# Altium schematic sheet llrf_afe_fpga_bridge.SchDoc: =GlobalProjectName
size 594 x 420 mm; SheetNumber: 7; SheetTotal: 20; PageSetup: Record=PageOptions|CenterHorizontal=True|CenterVertical=True|PrintScale=1.00|XCorrection=1.00|YCorrection=1.00|PrintKind=1|BorderSize=5000000|LeftOffset=0|BottomOffset=0|Orientation=2|PaperLength=1000|PaperWidth=1000|Scale=100|PaperSource=15|PrintQuality=1200|MediaType=1|DitherType=10|PaperKind=A3|PrintScaleMode=1; Weight: -; ScaleFactor: -
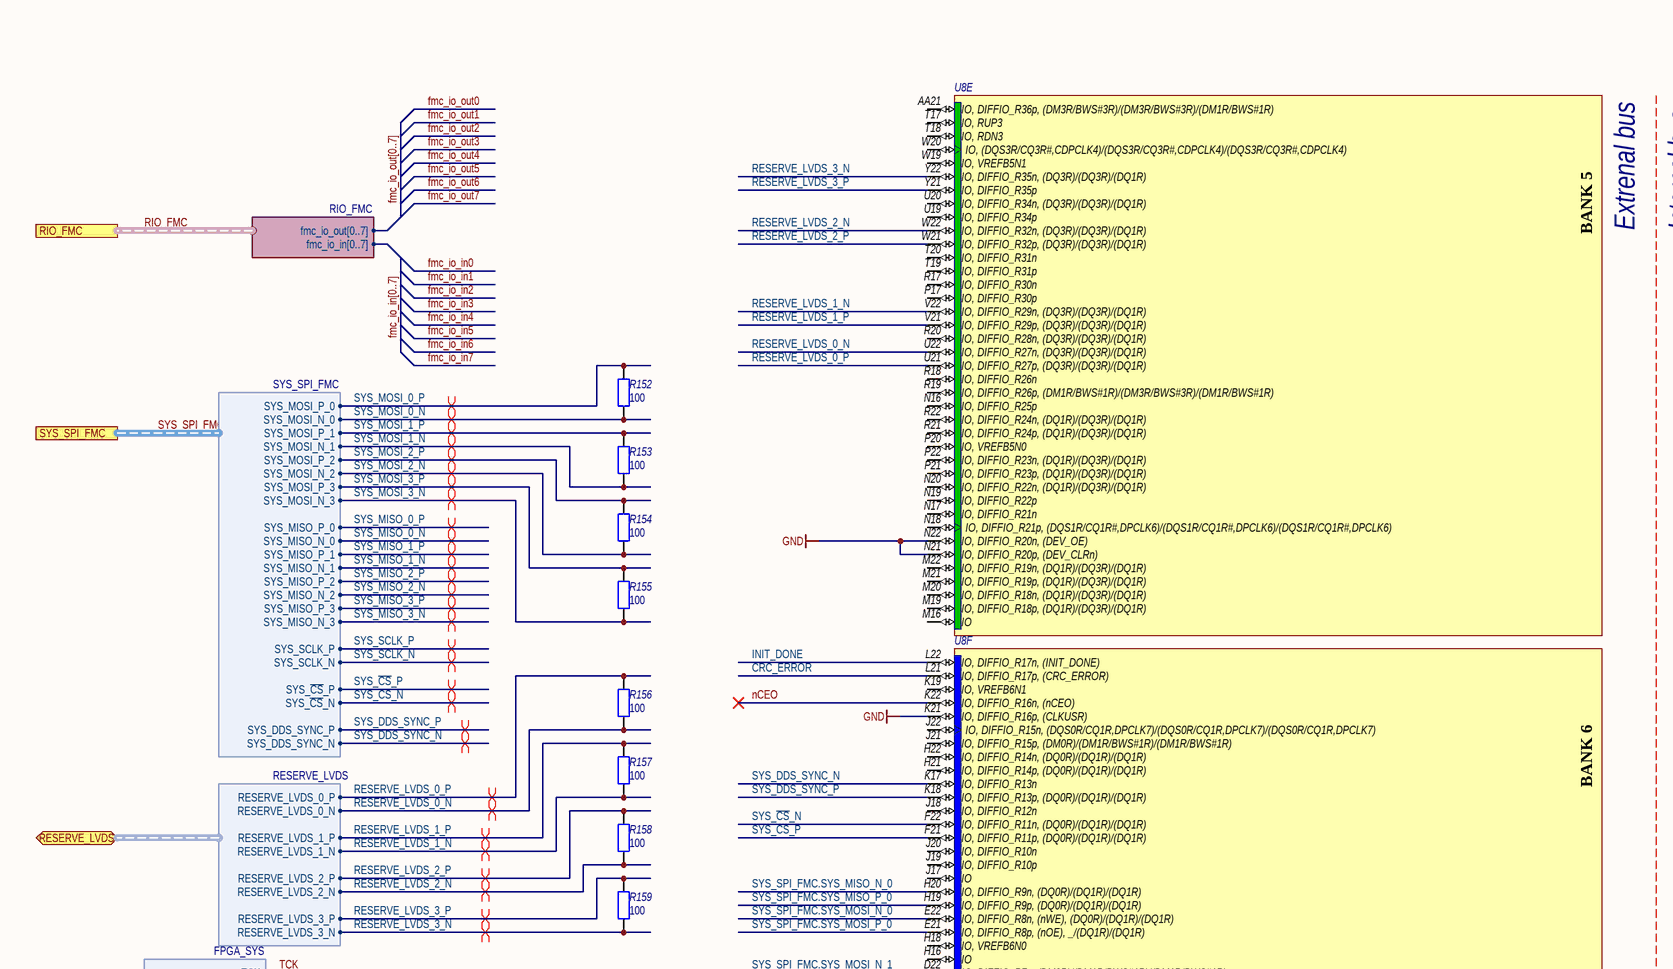
[diagram p0: llrf_afe_fpga_bridge.SchDoc, top left]
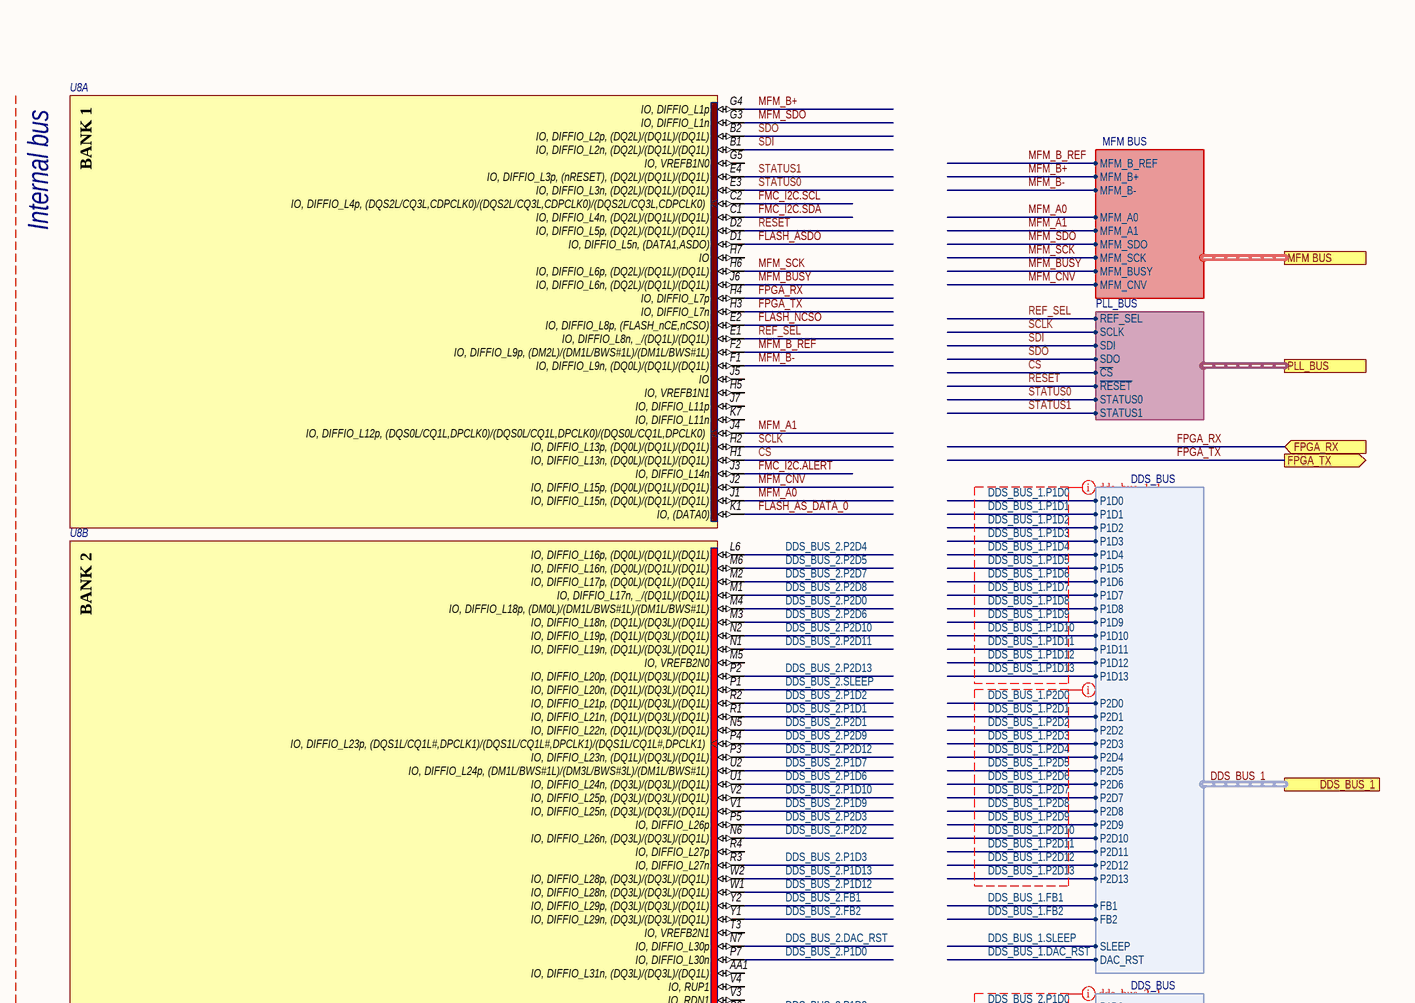
[diagram p1: llrf_afe_fpga_bridge.SchDoc, top right]
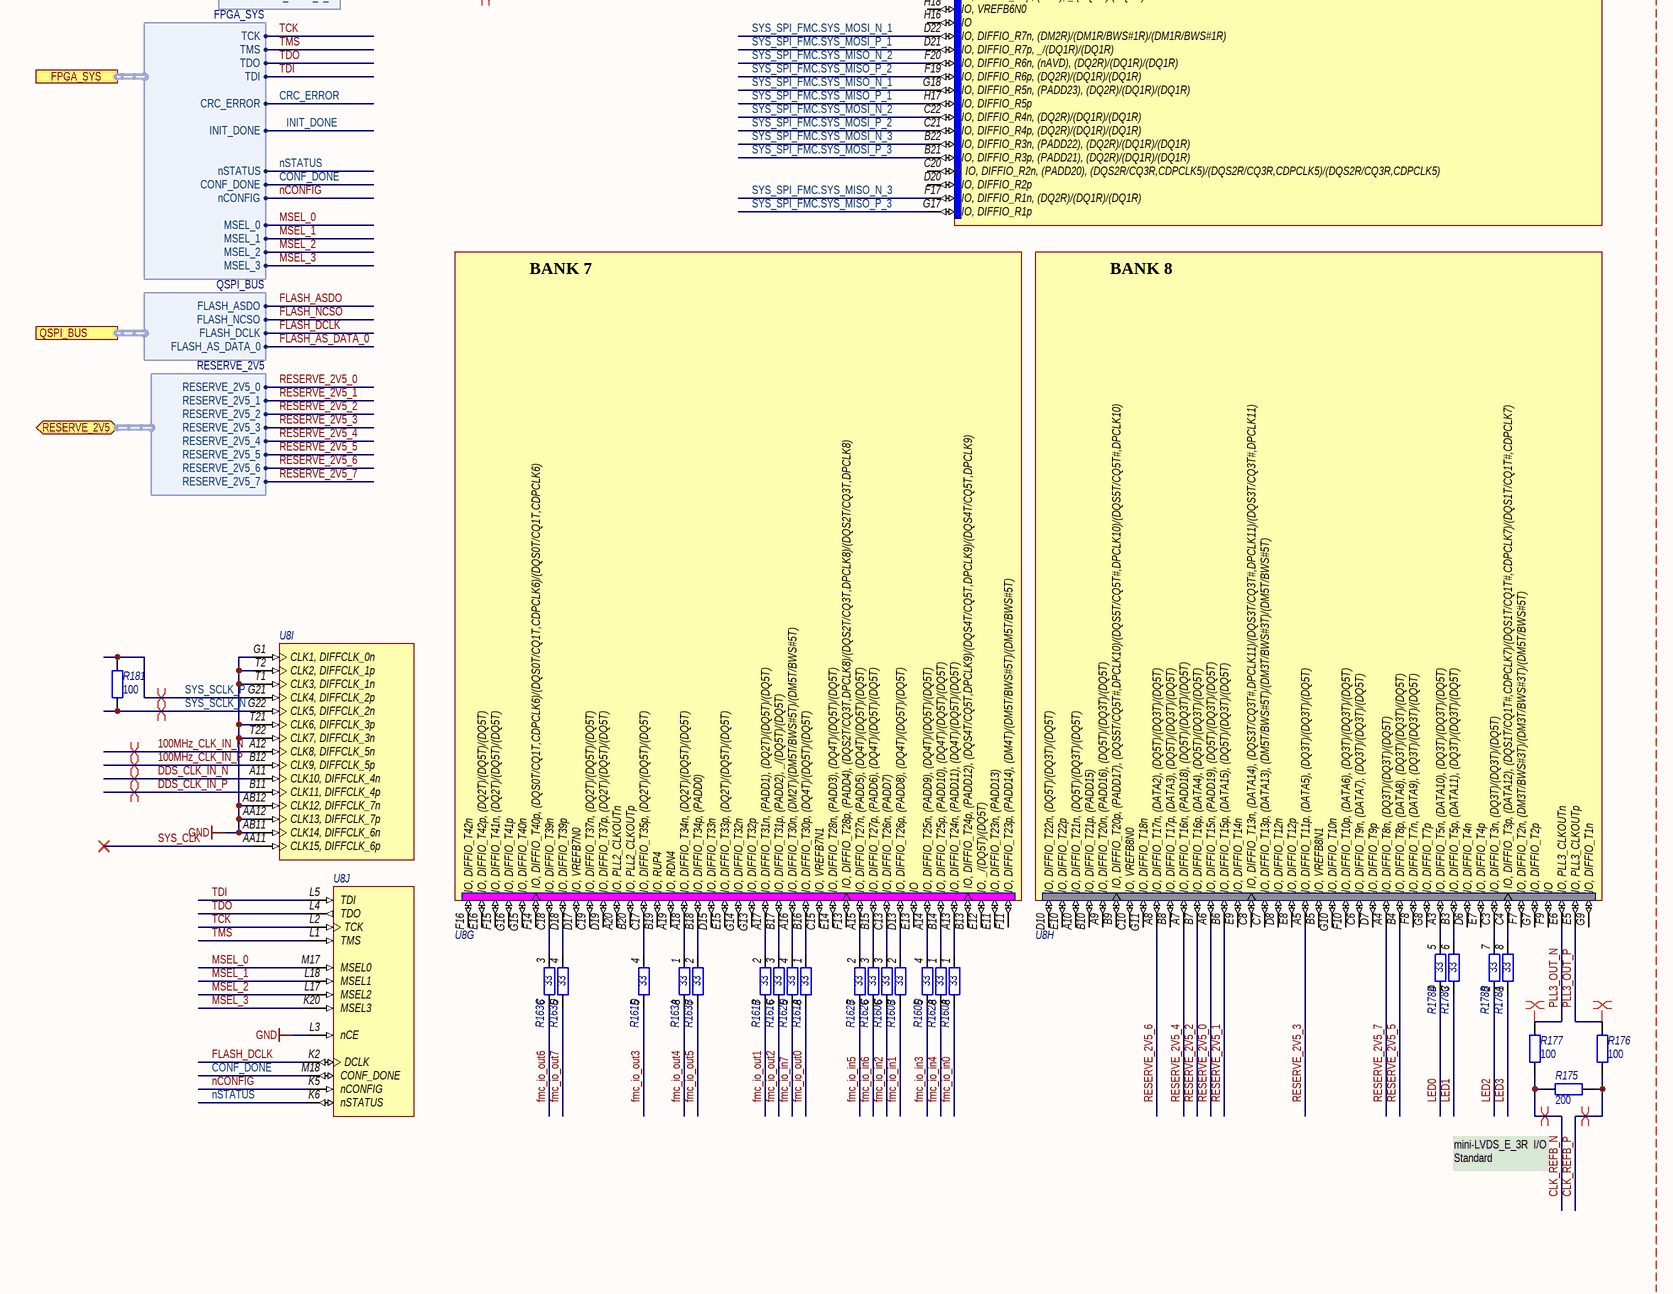
[diagram p2: llrf_afe_fpga_bridge.SchDoc, bottom left]
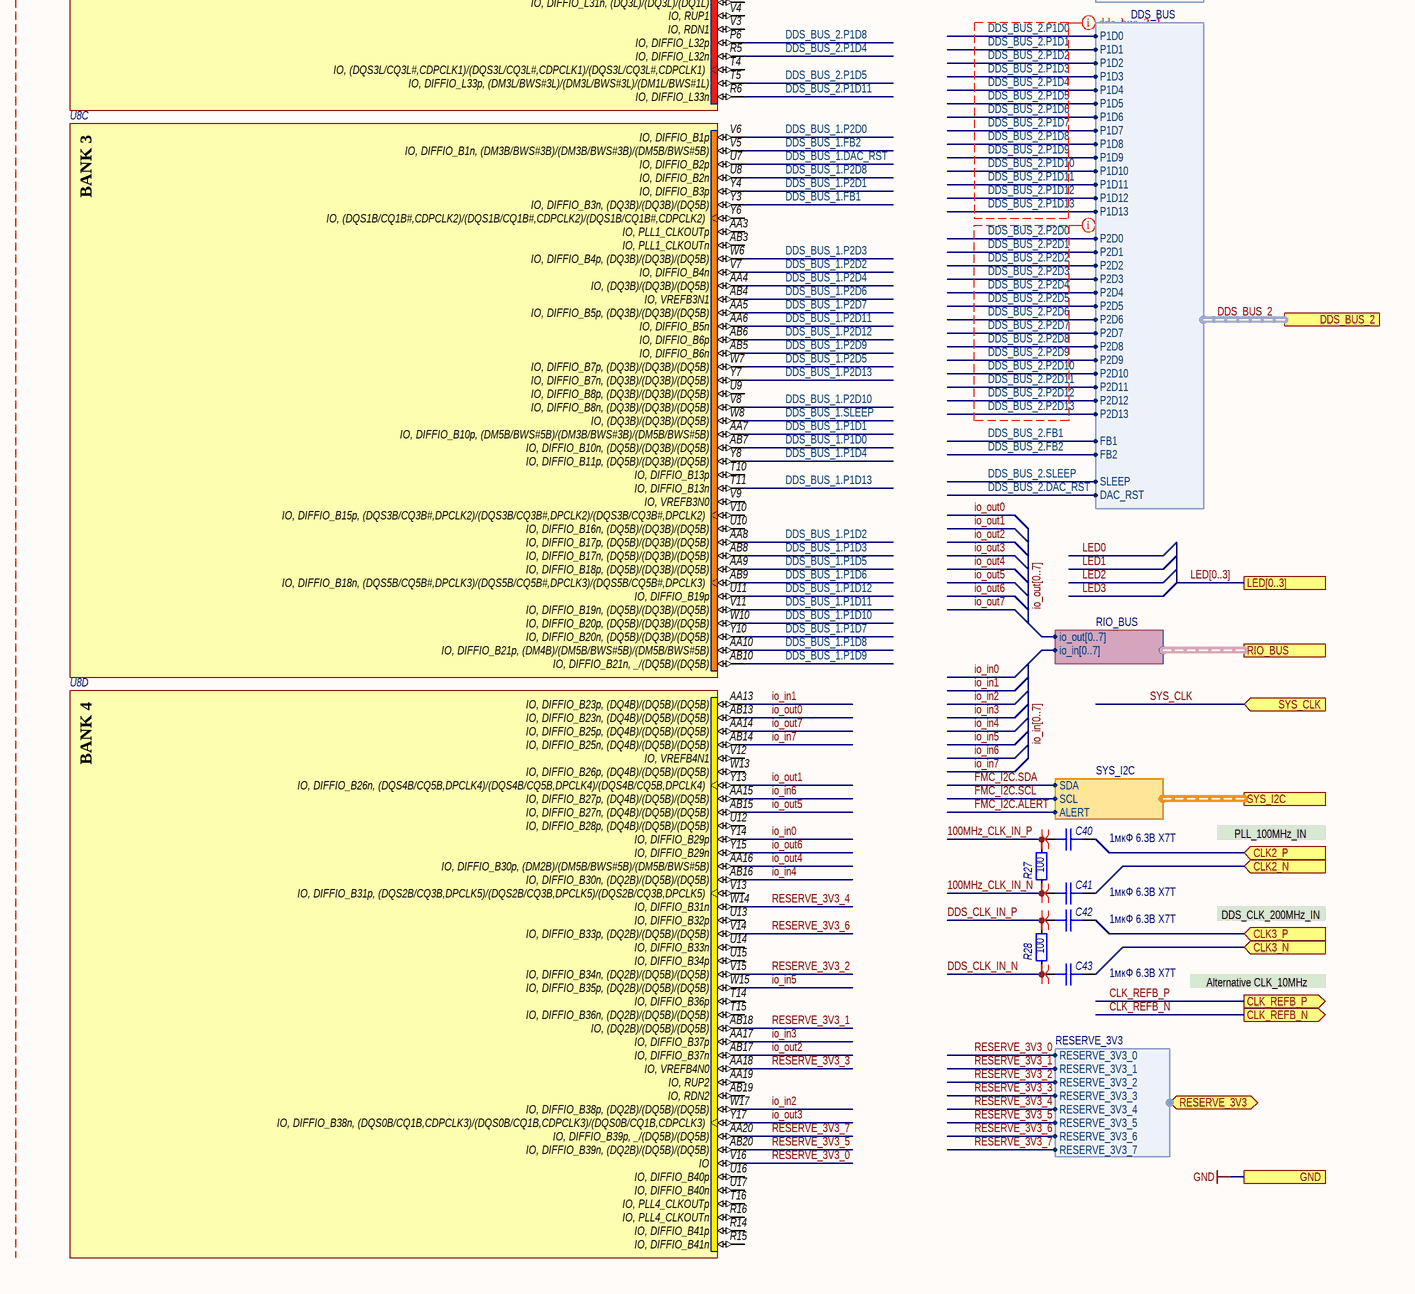
[diagram p3: llrf_afe_fpga_bridge.SchDoc, bottom right]

## Parts
C40  1мкФ 6.3В X7T  [SMD_C0603]
C41  1мкФ 6.3В X7T  [SMD_C0603]
C42  1мкФ 6.3В X7T  [SMD_C0603]
C43  1мкФ 6.3В X7T  [SMD_C0603]
R27  100  [SMD_0603]
R28  100  [SMD_0603]
R152  100  [SMD_0603]
R153  100  [SMD_0603]
R154  100  [SMD_0603]
R155  100  [SMD_0603]
R156  100  [SMD_0603]
R157  100  [SMD_0603]
R158  100  [SMD_0603]
R159  100  [SMD_0603]
R160  value 33  [TC124]  (hidden comment: 4 Chip Resistor Array)  (parts A,B,C,D of 4)
R161  value 33  [TC124]  (hidden comment: 4 Chip Resistor Array)  (parts A,B,C,D of 4)
R162  value 33  [TC124]  (hidden comment: 4 Chip Resistor Array)  (parts A,B,C,D of 4)
R163  value 33  [TC124]  (hidden comment: 4 Chip Resistor Array)  (parts A,B,C,D of 4)
R175  200  [SMD_0603]
R176  100  [SMD_0603]
R177  100  [SMD_0603]
R178  value 33  [TC124]  (hidden comment: 4 Chip Resistor Array)  (parts A,B,C,D of 4)
R181  100  [SMD_0603]
U8  EP4CE55F23C8  [FBGA484_A-240]  (value not drawn)  (parts A,B,C,D,E,F,G,H,I,J of 13)

## Ports
CLK2_N (in), CLK2_P (in), CLK3_N (in), CLK3_P (in), CLK_REFB_N (out), CLK_REFB_P (out), DDS_BUS_1 (harness DDS_BUS), DDS_BUS_2 (harness DDS_BUS), FPGA_RX (in), FPGA_SYS (harness FPGA_SYS), FPGA_TX (out), GND, LED[0..3], MFM BUS (harness MFM BUS), PLL_BUS (harness PLL_BUS), QSPI_BUS (harness QSPI_BUS), RESERVE_2V5 (bidir, harness RESERVE_2V5), RESERVE_3V3 (bidir, harness RESERVE_3V3), RESERVE_LVDS (bidir, harness RESERVE_LVDS), RIO_BUS (harness RIO_BUS), RIO_FMC (harness RIO_FMC), SYS_CLK (in), SYS_I2C (harness SYS_I2C), SYS_SPI_FMC (harness SYS_SPI_FMC)

## Harnesses
MFM BUS: MFM_A0, MFM_A1, MFM_SDO, MFM_SCK, MFM_BUSY, MFM_CNV, MFM_B_REF, MFM_B+, MFM_B-
RIO_FMC: fmc_io_out[0..7], fmc_io_in[0..7]
FPGA_SYS: TCK, TMS, TDO, TDI, CRC_ERROR, nSTATUS, CONF_DONE, nCONFIG, MSEL_0, MSEL_1, MSEL_2, MSEL_3, INIT_DONE
SYS_SPI_FMC: SYS_MOSI_P_0, SYS_SCLK_P, SYS_~{CS}_P, SYS_MOSI_P_1, SYS_MOSI_P_2, SYS_MOSI_P_3, SYS_MOSI_N_0, SYS_MOSI_N_1, SYS_MOSI_N_2, SYS_MOSI_N_3, SYS_MISO_P_0, SYS_MISO_P_1, SYS_MISO_P_2, SYS_MISO_P_3, SYS_MISO_N_0, SYS_MISO_N_1, SYS_MISO_N_2, SYS_MISO_N_3, SYS_SCLK_N, SYS_DDS_SYNC_P, SYS_~{CS}_N, SYS_DDS_SYNC_N
SYS_I2C: SDA, SCL, ALERT
PLL_BUS: REF_SEL, SCLK, SDI, SDO, ~{CS}, ~{RESET}, STATUS0, STATUS1
RIO_BUS: io_out[0..7], io_in[0..7]
RESERVE_LVDS: RESERVE_LVDS_0_P, RESERVE_LVDS_0_N, RESERVE_LVDS_1_P, RESERVE_LVDS_1_N, RESERVE_LVDS_2_P, RESERVE_LVDS_2_N, RESERVE_LVDS_3_P, RESERVE_LVDS_3_N
RESERVE_3V3: RESERVE_3V3_0, RESERVE_3V3_1, RESERVE_3V3_2, RESERVE_3V3_3, RESERVE_3V3_4, RESERVE_3V3_5, RESERVE_3V3_6, RESERVE_3V3_7
QSPI_BUS: FLASH_ASDO, FLASH_NCSO, FLASH_DCLK, FLASH_AS_DATA_0
RESERVE_2V5: RESERVE_2V5_0, RESERVE_2V5_1, RESERVE_2V5_2, RESERVE_2V5_3, RESERVE_2V5_4, RESERVE_2V5_5, RESERVE_2V5_6, RESERVE_2V5_7
DDS_BUS: P1D0, P1D1, P1D2, P1D3, P1D4, P1D5, P1D6, P1D7, P1D8, P1D9, P1D10, P1D11, P1D12, P1D13, P2D0, P2D1, P2D2, P2D3, P2D4, P2D5, P2D6, P2D7, P2D8, P2D9, P2D10, P2D11, P2D12, P2D13, FB1, SLEEP, DAC_RST, FB2

## Nets
GND: U8.AA12(CLK13,_DIFFCLK_7p) U8.AB11(CLK14,_DIFFCLK_6n) U8.AB12(CLK12,_DIFFCLK_7n) U8.G1(CLK1,_DIFFCLK_0n) U8.K21(IO,_DIFFIO_R16p,_(CLKUSR)) U8.L3(nCE) U8.N21(IO,_DIFFIO_R20p,_(DEV_CLRn)) U8.N22(IO,_DIFFIO_R20n,_(DEV_OE)) U8.T1(CLK3,_DIFFCLK_1n) U8.T2(CLK2,_DIFFCLK_1p) U8.T21(CLK6,_DIFFCLK_3p) U8.T22(CLK7,_DIFFCLK_3n) ; port GND
100MHz_CLK_IN_N: C41.1 R27.1 U8.A12(CLK8,_DIFFCLK_5n)
100MHz_CLK_IN_P: C40.2 R27.2 U8.B12(CLK9,_DIFFCLK_5p)
~{CS}: U8.H1(IO,_DIFFIO_L13n,_(DQ0L)/(DQ1L)/(DQ1L)) ; port PLL_BUS.~{CS}
CLK2_N: C41.2 ; port CLK2_N
CLK2_P: C40.1 ; port CLK2_P
CLK3_N: C43.2 ; port CLK3_N
CLK3_P: C42.1 ; port CLK3_P
CLK_REFB_N: R175.2 R177.2 ; port CLK_REFB_N
CLK_REFB_P: R175.1 R176.2 ; port CLK_REFB_P
CONF_DONE: U8.M18(CONF_DONE) ; port FPGA_SYS.CONF_DONE
CRC_ERROR: U8.L21(IO,_DIFFIO_R17p,_(CRC_ERROR)) ; port FPGA_SYS.CRC_ERROR
DDS_BUS_1.DAC_RST: U8.U7(IO,_DIFFIO_B2p) ; port DDS_BUS_1.DAC_RST
DDS_BUS_1.FB1: U8.Y3(IO,_DIFFIO_B3n,_(DQ3B)/(DQ3B)/(DQ5B)) ; port DDS_BUS_1.FB1
DDS_BUS_1.FB2: U8.V5(IO,_DIFFIO_B1n,_(DM3B/BWS#3B)/(DM3B/BWS#3B)/(DM5B/BWS#5B)) ; port DDS_BUS_1.FB2
DDS_BUS_1.P1D0: U8.AB7(IO,_DIFFIO_B10n,_(DQ5B)/(DQ3B)/(DQ5B)) ; port DDS_BUS_1.P1D0
DDS_BUS_1.P1D1: U8.AA7(IO,_DIFFIO_B10p,_(DM5B/BWS#5B)/(DM3B/BWS#3B)/(DM5B/BWS#5B)) ; port DDS_BUS_1.P1D1
DDS_BUS_1.P1D2: U8.AA8(IO,_DIFFIO_B17p,_(DQ5B)/(DQ3B)/(DQ5B)) ; port DDS_BUS_1.P1D2
DDS_BUS_1.P1D3: U8.AB8(IO,_DIFFIO_B17n,_(DQ5B)/(DQ3B)/(DQ5B)) ; port DDS_BUS_1.P1D3
DDS_BUS_1.P1D4: U8.Y8(IO,_DIFFIO_B11p,_(DQ5B)/(DQ3B)/(DQ5B)) ; port DDS_BUS_1.P1D4
DDS_BUS_1.P1D5: U8.AA9(IO,_DIFFIO_B18p,_(DQ5B)/(DQ3B)/(DQ5B)) ; port DDS_BUS_1.P1D5
DDS_BUS_1.P1D6: U8.AB9(IO,_DIFFIO_B18n,_(DQS5B/CQ5B#,DPCLK3)/(DQS5B/CQ5B#,DPCLK3)/(DQS5B/CQ5B#,DPCLK3)) ; port DDS_BUS_1.P1D6
DDS_BUS_1.P1D7: U8.Y10(IO,_DIFFIO_B20n,_(DQ5B)/(DQ3B)/(DQ5B)) ; port DDS_BUS_1.P1D7
DDS_BUS_1.P1D8: U8.AA10(IO,_DIFFIO_B21p,_(DM4B)/(DM5B/BWS#5B)/(DM5B/BWS#5B)) ; port DDS_BUS_1.P1D8
DDS_BUS_1.P1D9: U8.AB10(IO,_DIFFIO_B21n,__/(DQ5B)/(DQ5B)) ; port DDS_BUS_1.P1D9
DDS_BUS_1.P1D10: U8.W10(IO,_DIFFIO_B20p,_(DQ5B)/(DQ3B)/(DQ5B)) ; port DDS_BUS_1.P1D10
DDS_BUS_1.P1D11: U8.V11(IO,_DIFFIO_B19n,_(DQ5B)/(DQ3B)/(DQ5B)) ; port DDS_BUS_1.P1D11
DDS_BUS_1.P1D12: U8.U11(IO,_DIFFIO_B19p) ; port DDS_BUS_1.P1D12
DDS_BUS_1.P1D13: U8.T11(IO,_DIFFIO_B13n) ; port DDS_BUS_1.P1D13
DDS_BUS_1.P2D0: U8.V6(IO,_DIFFIO_B1p) ; port DDS_BUS_1.P2D0
DDS_BUS_1.P2D1: U8.Y4(IO,_DIFFIO_B3p) ; port DDS_BUS_1.P2D1
DDS_BUS_1.P2D2: U8.V7(IO,_DIFFIO_B4n) ; port DDS_BUS_1.P2D2
DDS_BUS_1.P2D3: U8.W6(IO,_DIFFIO_B4p,_(DQ3B)/(DQ3B)/(DQ5B)) ; port DDS_BUS_1.P2D3
DDS_BUS_1.P2D4: U8.AA4(IO,_(DQ3B)/(DQ3B)/(DQ5B)) ; port DDS_BUS_1.P2D4
DDS_BUS_1.P2D5: U8.W7(IO,_DIFFIO_B7p,_(DQ3B)/(DQ3B)/(DQ5B)) ; port DDS_BUS_1.P2D5
DDS_BUS_1.P2D6: U8.AB4(IO,_VREFB3N1) ; port DDS_BUS_1.P2D6
DDS_BUS_1.P2D7: U8.AA5(IO,_DIFFIO_B5p,_(DQ3B)/(DQ3B)/(DQ5B)) ; port DDS_BUS_1.P2D7
DDS_BUS_1.P2D8: U8.U8(IO,_DIFFIO_B2n) ; port DDS_BUS_1.P2D8
DDS_BUS_1.P2D9: U8.AB5(IO,_DIFFIO_B6n) ; port DDS_BUS_1.P2D9
DDS_BUS_1.P2D10: U8.V8(IO,_DIFFIO_B8n,_(DQ3B)/(DQ3B)/(DQ5B)) ; port DDS_BUS_1.P2D10
DDS_BUS_1.P2D11: U8.AA6(IO,_DIFFIO_B5n) ; port DDS_BUS_1.P2D11
DDS_BUS_1.P2D12: U8.AB6(IO,_DIFFIO_B6p) ; port DDS_BUS_1.P2D12
DDS_BUS_1.P2D13: U8.Y7(IO,_DIFFIO_B7n,_(DQ3B)/(DQ3B)/(DQ5B)) ; port DDS_BUS_1.P2D13
DDS_BUS_1.SLEEP: U8.W8(IO,_(DQ3B)/(DQ3B)/(DQ5B)) ; port DDS_BUS_1.SLEEP
DDS_BUS_2.DAC_RST: U8.N7(IO,_DIFFIO_L30p) ; port DDS_BUS_2.DAC_RST
DDS_BUS_2.FB1: U8.Y2(IO,_DIFFIO_L29p,_(DQ3L)/(DQ3L)/(DQ1L)) ; port DDS_BUS_2.FB1
DDS_BUS_2.FB2: U8.Y1(IO,_DIFFIO_L29n,_(DQ3L)/(DQ3L)/(DQ1L)) ; port DDS_BUS_2.FB2
DDS_BUS_2.P1D0: U8.P7(IO,_DIFFIO_L30n) ; port DDS_BUS_2.P1D0
DDS_BUS_2.P1D1: U8.R1(IO,_DIFFIO_L21n,_(DQ1L)/(DQ3L)/(DQ1L)) ; port DDS_BUS_2.P1D1
DDS_BUS_2.P1D2: U8.R2(IO,_DIFFIO_L21p,_(DQ1L)/(DQ3L)/(DQ1L)) ; port DDS_BUS_2.P1D2
DDS_BUS_2.P1D3: U8.R3(IO,_DIFFIO_L27n) ; port DDS_BUS_2.P1D3
DDS_BUS_2.P1D4: U8.R5(IO,_DIFFIO_L32n) ; port DDS_BUS_2.P1D4
DDS_BUS_2.P1D5: U8.T5(IO,_DIFFIO_L33p,_(DM3L/BWS#3L)/(DM3L/BWS#3L)/(DM1L/BWS#1L)) ; port DDS_BUS_2.P1D5
DDS_BUS_2.P1D6: U8.U1(IO,_DIFFIO_L24n,_(DQ3L)/(DQ3L)/(DQ1L)) ; port DDS_BUS_2.P1D6
DDS_BUS_2.P1D7: U8.U2(IO,_DIFFIO_L24p,_(DM1L/BWS#1L)/(DM3L/BWS#3L)/(DM1L/BWS#1L)) ; port DDS_BUS_2.P1D7
DDS_BUS_2.P1D8: U8.P6(IO,_DIFFIO_L32p) ; port DDS_BUS_2.P1D8
DDS_BUS_2.P1D9: U8.V1(IO,_DIFFIO_L25n,_(DQ3L)/(DQ3L)/(DQ1L)) ; port DDS_BUS_2.P1D9
DDS_BUS_2.P1D10: U8.V2(IO,_DIFFIO_L25p,_(DQ3L)/(DQ3L)/(DQ1L)) ; port DDS_BUS_2.P1D10
DDS_BUS_2.P1D11: U8.R6(IO,_DIFFIO_L33n) ; port DDS_BUS_2.P1D11
DDS_BUS_2.P1D12: U8.W1(IO,_DIFFIO_L28n,_(DQ3L)/(DQ3L)/(DQ1L)) ; port DDS_BUS_2.P1D12
DDS_BUS_2.P1D13: U8.W2(IO,_DIFFIO_L28p,_(DQ3L)/(DQ3L)/(DQ1L)) ; port DDS_BUS_2.P1D13
DDS_BUS_2.P2D0: U8.M4(IO,_DIFFIO_L18p,_(DM0L)/(DM1L/BWS#1L)/(DM1L/BWS#1L)) ; port DDS_BUS_2.P2D0
DDS_BUS_2.P2D1: U8.N5(IO,_DIFFIO_L22n,_(DQ1L)/(DQ3L)/(DQ1L)) ; port DDS_BUS_2.P2D1
DDS_BUS_2.P2D2: U8.N6(IO,_DIFFIO_L26n,_(DQ3L)/(DQ3L)/(DQ1L)) ; port DDS_BUS_2.P2D2
DDS_BUS_2.P2D3: U8.P5(IO,_DIFFIO_L26p) ; port DDS_BUS_2.P2D3
DDS_BUS_2.P2D4: U8.L6(IO,_DIFFIO_L16p,_(DQ0L)/(DQ1L)/(DQ1L)) ; port DDS_BUS_2.P2D4
DDS_BUS_2.P2D5: U8.M6(IO,_DIFFIO_L16n,_(DQ0L)/(DQ1L)/(DQ1L)) ; port DDS_BUS_2.P2D5
DDS_BUS_2.P2D6: U8.M3(IO,_DIFFIO_L18n,_(DQ1L)/(DQ3L)/(DQ1L)) ; port DDS_BUS_2.P2D6
DDS_BUS_2.P2D7: U8.M2(IO,_DIFFIO_L17p,_(DQ0L)/(DQ1L)/(DQ1L)) ; port DDS_BUS_2.P2D7
DDS_BUS_2.P2D8: U8.M1(IO,_DIFFIO_L17n,__/(DQ1L)/(DQ1L)) ; port DDS_BUS_2.P2D8
DDS_BUS_2.P2D9: U8.P4(IO,_DIFFIO_L23p,_(DQS1L/CQ1L#,DPCLK1)/(DQS1L/CQ1L#,DPCLK1)/(DQS1L/CQ1L#,DPCLK1)) ; port DDS_BUS_2.P2D9
DDS_BUS_2.P2D10: U8.N2(IO,_DIFFIO_L19p,_(DQ1L)/(DQ3L)/(DQ1L)) ; port DDS_BUS_2.P2D10
DDS_BUS_2.P2D11: U8.N1(IO,_DIFFIO_L19n,_(DQ1L)/(DQ3L)/(DQ1L)) ; port DDS_BUS_2.P2D11
DDS_BUS_2.P2D12: U8.P3(IO,_DIFFIO_L23n,_(DQ1L)/(DQ3L)/(DQ1L)) ; port DDS_BUS_2.P2D12
DDS_BUS_2.P2D13: U8.P2(IO,_DIFFIO_L20p,_(DQ1L)/(DQ3L)/(DQ1L)) ; port DDS_BUS_2.P2D13
DDS_BUS_2.SLEEP: U8.P1(IO,_DIFFIO_L20n,_(DQ1L)/(DQ3L)/(DQ1L)) ; port DDS_BUS_2.SLEEP
DDS_CLK_IN_N: C43.1 R28.1 U8.A11(CLK10,_DIFFCLK_4n)
DDS_CLK_IN_P: C42.2 R28.2 U8.B11(CLK11,_DIFFCLK_4p)
FLASH_AS_DATA_0: U8.K1(IO,_(DATA0)) ; port QSPI_BUS.FLASH_AS_DATA_0
FLASH_ASDO: U8.D1(IO,_DIFFIO_L5n,_(DATA1,ASDO)) ; port QSPI_BUS.FLASH_ASDO
FLASH_DCLK: U8.K2(DCLK) ; port QSPI_BUS.FLASH_DCLK
FLASH_NCSO: U8.E2(IO,_DIFFIO_L8p,_(FLASH_nCE,nCSO)) ; port QSPI_BUS.FLASH_NCSO
FMC_I2C.ALERT: U8.J3(IO,_DIFFIO_L14n) ; port SYS_I2C.ALERT
FMC_I2C.SCL: U8.C2(IO,_DIFFIO_L4p,_(DQS2L/CQ3L,CDPCLK0)/(DQS2L/CQ3L,CDPCLK0)/(DQS2L/CQ3L,CDPCLK0)) ; port SYS_I2C.SCL
FMC_I2C.SDA: U8.C1(IO,_DIFFIO_L4n,_(DQ2L)/(DQ1L)/(DQ1L)) ; port SYS_I2C.SDA
fmc_io_in0: R160.8
fmc_io_in1: R160.7
fmc_io_in2: R160.6
fmc_io_in3: R160.5
fmc_io_in4: R162.8
fmc_io_in5: R162.7
fmc_io_in6: R162.6
fmc_io_in7: R162.5
fmc_io_out0: R161.8
fmc_io_out1: R161.7
fmc_io_out2: R161.6
fmc_io_out3: R161.5
fmc_io_out4: R163.8
fmc_io_out5: R163.7
fmc_io_out6: R163.6
fmc_io_out7: R163.5
FPGA_RX: U8.H4(IO,_DIFFIO_L7p) ; port FPGA_RX
FPGA_TX: U8.H3(IO,_DIFFIO_L7n) ; port FPGA_TX
INIT_DONE: U8.L22(IO,_DIFFIO_R17n,_(INIT_DONE)) ; port FPGA_SYS.INIT_DONE
io_in0: U8.Y14(IO,_DIFFIO_B29p)
io_in1: U8.AA13(IO,_DIFFIO_B23p,_(DQ4B)/(DQ5B)/(DQ5B))
io_in2: U8.W17(IO,_DIFFIO_B38p,_(DQ2B)/(DQ5B)/(DQ5B))
io_in3: U8.AA17(IO,_DIFFIO_B37p)
io_in4: U8.AB16(IO,_DIFFIO_B30n,_(DQ2B)/(DQ5B)/(DQ5B))
io_in5: U8.W15(IO,_DIFFIO_B35p,_(DQ2B)/(DQ5B)/(DQ5B))
io_in6: U8.AA15(IO,_DIFFIO_B27p,_(DQ4B)/(DQ5B)/(DQ5B))
io_in7: U8.AB14(IO,_DIFFIO_B25n,_(DQ4B)/(DQ5B)/(DQ5B))
io_out0: U8.AB13(IO,_DIFFIO_B23n,_(DQ4B)/(DQ5B)/(DQ5B))
io_out1: U8.Y13(IO,_DIFFIO_B26n,_(DQS4B/CQ5B,DPCLK4)/(DQS4B/CQ5B,DPCLK4)/(DQS4B/CQ5B,DPCLK4))
io_out2: U8.AB17(IO,_DIFFIO_B37n)
io_out3: U8.Y17(IO,_DIFFIO_B38n,_(DQS0B/CQ1B,CDPCLK3)/(DQS0B/CQ1B,CDPCLK3)/(DQS0B/CQ1B,CDPCLK3))
io_out4: U8.AA16(IO,_DIFFIO_B30p,_(DM2B)/(DM5B/BWS#5B)/(DM5B/BWS#5B))
io_out5: U8.AB15(IO,_DIFFIO_B27n,_(DQ4B)/(DQ5B)/(DQ5B))
io_out6: U8.Y15(IO,_DIFFIO_B29n)
io_out7: U8.AA14(IO,_DIFFIO_B25p,_(DQ4B)/(DQ5B)/(DQ5B))
LED0: R178.4
LED1: R178.3
LED2: R178.2
LED3: R178.1
MFM_A0: U8.J1(IO,_DIFFIO_L15n,_(DQ0L)/(DQ1L)/(DQ1L)) ; port MFM BUS.MFM_A0
MFM_A1: U8.J4(IO,_DIFFIO_L12p,_(DQS0L/CQ1L,DPCLK0)/(DQS0L/CQ1L,DPCLK0)/(DQS0L/CQ1L,DPCLK0)) ; port MFM BUS.MFM_A1
MFM_B+: U8.G4(IO,_DIFFIO_L1p) ; port MFM BUS.MFM_B+
MFM_B-: U8.F1(IO,_DIFFIO_L9n,_(DQ0L)/(DQ1L)/(DQ1L)) ; port MFM BUS.MFM_B-
MFM_B_REF: U8.F2(IO,_DIFFIO_L9p,_(DM2L)/(DM1L/BWS#1L)/(DM1L/BWS#1L)) ; port MFM BUS.MFM_B_REF
MFM_BUSY: U8.J6(IO,_DIFFIO_L6n,_(DQ2L)/(DQ1L)/(DQ1L)) ; port MFM BUS.MFM_BUSY
MFM_CNV: U8.J2(IO,_DIFFIO_L15p,_(DQ0L)/(DQ1L)/(DQ1L)) ; port MFM BUS.MFM_CNV
MFM_SCK: U8.H6(IO,_DIFFIO_L6p,_(DQ2L)/(DQ1L)/(DQ1L)) ; port MFM BUS.MFM_SCK
MFM_SDO: U8.G3(IO,_DIFFIO_L1n) ; port MFM BUS.MFM_SDO
MSEL_0: U8.M17(MSEL0) ; port FPGA_SYS.MSEL_0
MSEL_1: U8.L18(MSEL1) ; port FPGA_SYS.MSEL_1
MSEL_2: U8.L17(MSEL2) ; port FPGA_SYS.MSEL_2
MSEL_3: U8.K20(MSEL3) ; port FPGA_SYS.MSEL_3
nCEO: U8.K22(IO,_DIFFIO_R16n,_(nCEO))
nCONFIG: U8.K5(nCONFIG) ; port FPGA_SYS.nCONFIG
nSTATUS: U8.K6(nSTATUS) ; port FPGA_SYS.nSTATUS
PLL3_OUT_N: R177.1 U8.E6(IO,_PLL3_CLKOUTn)
PLL3_OUT_P: R176.1 U8.E5(IO,_PLL3_CLKOUTp)
~{RESET}: U8.D2(IO,_DIFFIO_L5p,_(DQ2L)/(DQ1L)/(DQ1L)) ; port PLL_BUS.~{RESET}
REF_SEL: U8.E1(IO,_DIFFIO_L8n,__/(DQ1L)/(DQ1L)) ; port PLL_BUS.REF_SEL
RESERVE_2V5_0: U8.A6(IO,_DIFFIO_T15n,_(PADD19),_(DQ5T)/(DQ3T)/(DQ5T)) ; port RESERVE_2V5.RESERVE_2V5_0
RESERVE_2V5_1: U8.B6(IO,_DIFFIO_T15p,_(DATA15),_(DQ5T)/(DQ3T)/(DQ5T)) ; port RESERVE_2V5.RESERVE_2V5_1
RESERVE_2V5_2: U8.B7(IO,_DIFFIO_T16p,_(DATA4),_(DQ5T)/(DQ3T)/(DQ5T)) ; port RESERVE_2V5.RESERVE_2V5_2
RESERVE_2V5_3: U8.A5(IO,_DIFFIO_T11p,_(DATA5),_(DQ3T)/(DQ3T)/(DQ5T)) ; port RESERVE_2V5.RESERVE_2V5_3
RESERVE_2V5_4: U8.A7(IO,_DIFFIO_T16n,_(PADD18),_(DQ5T)/(DQ3T)/(DQ5T)) ; port RESERVE_2V5.RESERVE_2V5_4
RESERVE_2V5_5: U8.B4(IO,_DIFFIO_T8p,_(DATA8),_(DQ3T)/(DQ3T)/(DQ5T)) ; port RESERVE_2V5.RESERVE_2V5_5
RESERVE_2V5_6: U8.A8(IO,_DIFFIO_T17n,_(DATA2),_(DQ5T)/(DQ3T)/(DQ5T)) ; port RESERVE_2V5.RESERVE_2V5_6
RESERVE_2V5_7: U8.A4(IO,_DIFFIO_T8n,_(DQ3T)/(DQ3T)/(DQ5T)) ; port RESERVE_2V5.RESERVE_2V5_7
RESERVE_3V3_0: U8.V16(IO) ; port RESERVE_3V3.RESERVE_3V3_0
RESERVE_3V3_1: U8.AB18(IO,_(DQ2B)/(DQ5B)/(DQ5B)) ; port RESERVE_3V3.RESERVE_3V3_1
RESERVE_3V3_2: U8.V15(IO,_DIFFIO_B34n,_(DQ2B)/(DQ5B)/(DQ5B)) ; port RESERVE_3V3.RESERVE_3V3_2
RESERVE_3V3_3: U8.AA18(IO,_VREFB4N0) ; port RESERVE_3V3.RESERVE_3V3_3
RESERVE_3V3_4: U8.W14(IO,_DIFFIO_B31n) ; port RESERVE_3V3.RESERVE_3V3_4
RESERVE_3V3_5: U8.AB20(IO,_DIFFIO_B39n,_(DQ2B)/(DQ5B)/(DQ5B)) ; port RESERVE_3V3.RESERVE_3V3_5
RESERVE_3V3_6: U8.V14(IO,_DIFFIO_B33p,_(DQ2B)/(DQ5B)/(DQ5B)) ; port RESERVE_3V3.RESERVE_3V3_6
RESERVE_3V3_7: U8.AA20(IO,_DIFFIO_B39p,__/(DQ5B)/(DQ5B)) ; port RESERVE_3V3.RESERVE_3V3_7
RESERVE_LVDS_0_N: R156.2 U8.U22(IO,_DIFFIO_R27n,_(DQ3R)/(DQ3R)/(DQ1R)) ; port RESERVE_LVDS.RESERVE_LVDS_0_N
RESERVE_LVDS_0_P: R156.1 U8.U21(IO,_DIFFIO_R27p,_(DQ3R)/(DQ3R)/(DQ1R)) ; port RESERVE_LVDS.RESERVE_LVDS_0_P
RESERVE_LVDS_1_N: R157.2 U8.V22(IO,_DIFFIO_R29n,_(DQ3R)/(DQ3R)/(DQ1R)) ; port RESERVE_LVDS.RESERVE_LVDS_1_N
RESERVE_LVDS_1_P: R157.1 U8.V21(IO,_DIFFIO_R29p,_(DQ3R)/(DQ3R)/(DQ1R)) ; port RESERVE_LVDS.RESERVE_LVDS_1_P
RESERVE_LVDS_2_N: R158.2 U8.W22(IO,_DIFFIO_R32n,_(DQ3R)/(DQ3R)/(DQ1R)) ; port RESERVE_LVDS.RESERVE_LVDS_2_N
RESERVE_LVDS_2_P: R158.1 U8.W21(IO,_DIFFIO_R32p,_(DQ3R)/(DQ3R)/(DQ1R)) ; port RESERVE_LVDS.RESERVE_LVDS_2_P
RESERVE_LVDS_3_N: R159.2 U8.Y22(IO,_DIFFIO_R35n,_(DQ3R)/(DQ3R)/(DQ1R)) ; port RESERVE_LVDS.RESERVE_LVDS_3_N
RESERVE_LVDS_3_P: R159.1 U8.Y21(IO,_DIFFIO_R35p) ; port RESERVE_LVDS.RESERVE_LVDS_3_P
SCLK: U8.H2(IO,_DIFFIO_L13p,_(DQ0L)/(DQ1L)/(DQ1L)) ; port PLL_BUS.SCLK
SDI: U8.B1(IO,_DIFFIO_L2n,_(DQ2L)/(DQ1L)/(DQ1L)) ; port PLL_BUS.SDI
SDO: U8.B2(IO,_DIFFIO_L2p,_(DQ2L)/(DQ1L)/(DQ1L)) ; port PLL_BUS.SDO
STATUS0: U8.E3(IO,_DIFFIO_L3n,_(DQ2L)/(DQ1L)/(DQ1L)) ; port PLL_BUS.STATUS0
STATUS1: U8.E4(IO,_DIFFIO_L3p,_(nRESET),_(DQ2L)/(DQ1L)/(DQ1L)) ; port PLL_BUS.STATUS1
SYS_~{CS}_N: U8.F22(IO,_DIFFIO_R11n,_(DQ0R)/(DQ1R)/(DQ1R)) ; port SYS_SPI_FMC.SYS_~{CS}_N
SYS_~{CS}_P: U8.F21(IO,_DIFFIO_R11p,_(DQ0R)/(DQ1R)/(DQ1R)) ; port SYS_SPI_FMC.SYS_~{CS}_P
SYS_CLK: U8.AA11(CLK15,_DIFFCLK_6p) ; port SYS_CLK
SYS_DDS_SYNC_N: U8.K17(IO,_DIFFIO_R13n) ; port SYS_SPI_FMC.SYS_DDS_SYNC_N
SYS_DDS_SYNC_P: U8.K18(IO,_DIFFIO_R13p,_(DQ0R)/(DQ1R)/(DQ1R)) ; port SYS_SPI_FMC.SYS_DDS_SYNC_P
SYS_MISO_0_N: port SYS_SPI_FMC.SYS_MISO_N_0
SYS_MISO_0_P: port SYS_SPI_FMC.SYS_MISO_P_0
SYS_MISO_1_N: port SYS_SPI_FMC.SYS_MISO_N_1
SYS_MISO_1_P: port SYS_SPI_FMC.SYS_MISO_P_1
SYS_MISO_2_N: port SYS_SPI_FMC.SYS_MISO_N_2
SYS_MISO_2_P: port SYS_SPI_FMC.SYS_MISO_P_2
SYS_MISO_3_N: port SYS_SPI_FMC.SYS_MISO_N_3
SYS_MISO_3_P: port SYS_SPI_FMC.SYS_MISO_P_3
SYS_MOSI_0_N: R152.2 ; port SYS_SPI_FMC.SYS_MOSI_N_0
SYS_MOSI_0_P: R152.1 ; port SYS_SPI_FMC.SYS_MOSI_P_0
SYS_MOSI_1_N: R153.2 ; port SYS_SPI_FMC.SYS_MOSI_N_1
SYS_MOSI_1_P: R153.1 ; port SYS_SPI_FMC.SYS_MOSI_P_1
SYS_MOSI_2_N: R154.2 ; port SYS_SPI_FMC.SYS_MOSI_N_2
SYS_MOSI_2_P: R154.1 ; port SYS_SPI_FMC.SYS_MOSI_P_2
SYS_MOSI_3_N: R155.2 ; port SYS_SPI_FMC.SYS_MOSI_N_3
SYS_MOSI_3_P: R155.1 ; port SYS_SPI_FMC.SYS_MOSI_P_3
SYS_SCLK_N: R181.2 U8.G22(CLK5,_DIFFCLK_2n) ; port SYS_SPI_FMC.SYS_SCLK_N
SYS_SCLK_P: R181.1 U8.G21(CLK4,_DIFFCLK_2p) ; port SYS_SPI_FMC.SYS_SCLK_P
SYS_SPI_FMC.SYS_MISO_N_0: U8.H20(IO,_DIFFIO_R9n,_(DQ0R)/(DQ1R)/(DQ1R))
SYS_SPI_FMC.SYS_MISO_N_1: U8.G18(IO,_DIFFIO_R5n,_(PADD23),_(DQ2R)/(DQ1R)/(DQ1R))
SYS_SPI_FMC.SYS_MISO_N_2: U8.F20(IO,_DIFFIO_R6n,_(nAVD),_(DQ2R)/(DQ1R)/(DQ1R))
SYS_SPI_FMC.SYS_MISO_N_3: U8.F17(IO,_DIFFIO_R1n,_(DQ2R)/(DQ1R)/(DQ1R))
SYS_SPI_FMC.SYS_MISO_P_0: U8.H19(IO,_DIFFIO_R9p,_(DQ0R)/(DQ1R)/(DQ1R))
SYS_SPI_FMC.SYS_MISO_P_1: U8.H17(IO,_DIFFIO_R5p)
SYS_SPI_FMC.SYS_MISO_P_2: U8.F19(IO,_DIFFIO_R6p,_(DQ2R)/(DQ1R)/(DQ1R))
SYS_SPI_FMC.SYS_MISO_P_3: U8.G17(IO,_DIFFIO_R1p)
SYS_SPI_FMC.SYS_MOSI_N_0: U8.E22(IO,_DIFFIO_R8n,_(nWE),_(DQ0R)/(DQ1R)/(DQ1R))
SYS_SPI_FMC.SYS_MOSI_N_1: U8.D22(IO,_DIFFIO_R7n,_(DM2R)/(DM1R/BWS#1R)/(DM1R/BWS#1R))
SYS_SPI_FMC.SYS_MOSI_N_2: U8.C22(IO,_DIFFIO_R4n,_(DQ2R)/(DQ1R)/(DQ1R))
SYS_SPI_FMC.SYS_MOSI_N_3: U8.B22(IO,_DIFFIO_R3n,_(PADD22),_(DQ2R)/(DQ1R)/(DQ1R))
SYS_SPI_FMC.SYS_MOSI_P_0: U8.E21(IO,_DIFFIO_R8p,_(nOE),__/(DQ1R)/(DQ1R))
SYS_SPI_FMC.SYS_MOSI_P_1: U8.D21(IO,_DIFFIO_R7p,__/(DQ1R)/(DQ1R))
SYS_SPI_FMC.SYS_MOSI_P_2: U8.C21(IO,_DIFFIO_R4p,_(DQ2R)/(DQ1R)/(DQ1R))
SYS_SPI_FMC.SYS_MOSI_P_3: U8.B21(IO,_DIFFIO_R3p,_(PADD21),_(DQ2R)/(DQ1R)/(DQ1R))
TCK: U8.L2(TCK) ; port FPGA_SYS.TCK
TDI: U8.L5(TDI) ; port FPGA_SYS.TDI
TDO: U8.L4(TDO) ; port FPGA_SYS.TDO
TMS: U8.L1(TMS) ; port FPGA_SYS.TMS
NetR160_1: R160.1 U8.A13(IO,_DIFFIO_T24n,_(PADD11),_(DQ4T)/(DQ5T)/(DQ5T))
NetR160_2: R160.2 U8.D13(IO,_DIFFIO_T26p,_(PADD8),_(DQ4T)/(DQ5T)/(DQ5T))
NetR160_3: R160.3 U8.C13(IO,_DIFFIO_T26n,_(PADD7))
NetR160_4: R160.4 U8.A14(IO,_DIFFIO_T25n,_(PADD9),_(DQ4T)/(DQ5T)/(DQ5T))
NetR161_1: R161.1 U8.B16(IO,_DIFFIO_T30p,_(DQ4T)/(DQ5T)/(DQ5T))
NetR161_2: R161.2 U8.A17(IO,_DIFFIO_T31n,_(PADD1),_(DQ2T)/(DQ5T)/(DQ5T))
NetR161_3: R161.3 U8.B17(IO,_DIFFIO_T31p,_(PADD2),__/(DQ5T)/(DQ5T))
NetR161_4: R161.4 U8.C17(IO,_DIFFIO_T35p,_(DQ2T)/(DQ5T)/(DQ5T))
NetR162_1: R162.1 U8.B14(IO,_DIFFIO_T25p,_(PADD10),_(DQ4T)/(DQ5T)/(DQ5T))
NetR162_2: R162.2 U8.A15(IO,_DIFFIO_T27n,_(PADD5),_(DQ4T)/(DQ5T)/(DQ5T))
NetR162_3: R162.3 U8.B15(IO,_DIFFIO_T27p,_(PADD6),_(DQ4T)/(DQ5T)/(DQ5T))
NetR162_4: R162.4 U8.A16(IO,_DIFFIO_T30n,_(DM2T)/(DM5T/BWS#5T)/(DM5T/BWS#5T))
NetR163_1: R163.1 U8.A18(IO,_DIFFIO_T34n,_(DQ2T)/(DQ5T)/(DQ5T))
NetR163_2: R163.2 U8.B18(IO,_DIFFIO_T34p,_(PADD0))
NetR163_3: R163.3 U8.C18(IO,_DIFFIO_T39n)
NetR163_4: R163.4 U8.D18(IO,_DIFFIO_T39p)
NetR178_5: R178.5 U8.A3(IO,_DIFFIO_T5n,_(DATA10),_(DQ3T)/(DQ3T)/(DQ5T))
NetR178_6: R178.6 U8.B3(IO,_DIFFIO_T5p,_(DATA11),_(DQ3T)/(DQ3T)/(DQ5T))
NetR178_7: R178.7 U8.C3(IO,_DIFFIO_T3n,_(DQ3T)/(DQ3T)/(DQ5T))
NetR178_8: R178.8 U8.C4(IO,_DIFFIO_T3p,_(DATA12),_(DQS1T/CQ1T#,CDPCLK7)/(DQS1T/CQ1T#,CDPCLK7)/(DQS1T/CQ1T#,CDPCLK7))

Not connected (* = marked no-connect by the designer): U8 A9(IO,_DIFFIO_T20n,_(PADD16),_(DQ5T)/(DQ3T)/(DQ5T)) A10(IO,_DIFFIO_T21n,_(DQ5T)/(DQ3T)/(DQ5T)) A19(IO,_RDN4) A20(IO,_PLL2_CLKOUTn) AA1(IO,_DIFFIO_L31n,_(DQ3L)/(DQ3L)/(DQ1L)) AA3(IO,_PLL1_CLKOUTp) AA19(IO,_RUP2) AA21(IO,_DIFFIO_R36p,_(DM3R/BWS#3R)/(DM3R/BWS#3R)/(DM1R/BWS#1R)) AB3(IO,_PLL1_CLKOUTn) AB19(IO,_RDN2) B5(IO,_VREFB8N1) B8(IO,_DIFFIO_T17p,_(DATA3),_(DQ5T)/(DQ3T)/(DQ5T)) B9(IO,_DIFFIO_T20p,_(PADD17),_(DQS5T/CQ5T#,DPCLK10)/(DQS5T/CQ5T#,DPCLK10)/(DQS5T/CQ5T#,DPCLK10)) B10(IO,_DIFFIO_T21p,_(PADD15)) B13(IO,_DIFFIO_T24p,_(PADD12),_(DQS4T/CQ5T,DPCLK9)/(DQS4T/CQ5T,DPCLK9)/(DQS4T/CQ5T,DPCLK9)) B19(IO,_RUP4) B20(IO,_PLL2_CLKOUTp) C6(IO,_DIFFIO_T9n,_(DATA7),_(DQ3T)/(DQ3T)/(DQ5T)) C7(IO,_DIFFIO_T13p,_(DATA13),_(DM5T/BWS#5T)/(DM3T/BWS#3T)/(DM5T/BWS#5T)) C8(IO,_DIFFIO_T13n,_(DATA14),_(DQS3T/CQ3T#,DPCLK11)/(DQS3T/CQ3T#,DPCLK11)/(DQS3T/CQ3T#,DPCLK11)) C10(IO,_VREFB8N0) C15(IO,_VREFB7N1) C19(IO,_DIFFIO_T37n,_(DQ2T)/(DQ5T)/(DQ5T)) C20(IO,_DIFFIO_R2n,_(PADD20),_(DQS2R/CQ3R,CDPCLK5)/(DQS2R/CQ3R,CDPCLK5)/(DQS2R/CQ3R,CDPCLK5)) D6(IO,_DIFFIO_T4n) D7(IO,_DIFFIO_T9p) D8(IO,_DIFFIO_T12n) D10(IO,_DIFFIO_T22n,_(DQ5T)/(DQ3T)/(DQ5T)) D15(IO,_DIFFIO_T33n) D17(IO,_VREFB7N0) D19(IO,_DIFFIO_T37p,_(DQ2T)/(DQ5T)/(DQ5T)) D20(IO,_DIFFIO_R2p) E7(IO,_DIFFIO_T4p) E8(IO,_DIFFIO_T12p) E9(IO,_DIFFIO_T14n) E10(IO,_DIFFIO_T22p) E11(IO,_DIFFIO_T23n,_(PADD13)) E12(IO,__/(DQ5T)/(DQ5T)) E13(IO) E14(IO,_DIFFIO_T28n,_(PADD3),_(DQ4T)/(DQ5T)/(DQ5T)) E15(IO,_DIFFIO_T33p,_(DQ2T)/(DQ5T)/(DQ5T)) E16(IO,_DIFFIO_T42p,_(DQ2T)/(DQ5T)/(DQ5T)) F7(IO,_DIFFIO_T2n,_(DM3T/BWS#3T)/(DM3T/BWS#3T)/(DM5T/BWS#5T)) F8(IO,_DIFFIO_T7n,_(DATA9),_(DQ3T)/(DQ3T)/(DQ5T)) F9(IO) F10(IO,_DIFFIO_T10p,_(DATA6),_(DQ3T)/(DQ3T)/(DQ5T)) F11(IO,_DIFFIO_T23p,_(PADD14),_(DM4T)/(DM5T/BWS#5T)/(DM5T/BWS#5T)) F13(IO,_DIFFIO_T28p,_(PADD4),_(DQS2T/CQ3T,DPCLK8)/(DQS2T/CQ3T,DPCLK8)/(DQS2T/CQ3T,DPCLK8)) F14(IO,_DIFFIO_T40p,_(DQS0T/CQ1T,CDPCLK6)/(DQS0T/CQ1T,CDPCLK6)/(DQS0T/CQ1T,CDPCLK6)) F15(IO,_DIFFIO_T41n,_(DQ2T)/(DQ5T)/(DQ5T)) F16(IO,_DIFFIO_T42n) G5(IO,_VREFB1N0) G7(IO,_DIFFIO_T2p) G8(IO,_DIFFIO_T7p) G9(IO,_DIFFIO_T1n) G10(IO,_DIFFIO_T10n) G11(IO,_DIFFIO_T18n) G13(IO,_DIFFIO_T32p) G14(IO,_DIFFIO_T32n) G15(IO,_DIFFIO_T40n) G16(IO,_DIFFIO_T41p) H5(IO,_VREFB1N1) H7(IO) H16(IO) H18(IO,_VREFB6N0) H21(IO,_DIFFIO_R14p,_(DQ0R)/(DQ1R)/(DQ1R)) H22(IO,_DIFFIO_R14n,_(DQ0R)/(DQ1R)/(DQ1R)) J5(IO) J7(IO,_DIFFIO_L11p) J17(IO) J18(IO,_DIFFIO_R12n) J19(IO,_DIFFIO_R10p) J20(IO,_DIFFIO_R10n) J21(IO,_DIFFIO_R15p,_(DM0R)/(DM1R/BWS#1R)/(DM1R/BWS#1R)) J22(IO,_DIFFIO_R15n,_(DQS0R/CQ1R,DPCLK7)/(DQS0R/CQ1R,DPCLK7)/(DQS0R/CQ1R,DPCLK7)) K7(IO,_DIFFIO_L11n) K19(IO,_VREFB6N1) M5(IO,_VREFB2N0) M16(IO) M19(IO,_DIFFIO_R18p,_(DQ1R)/(DQ3R)/(DQ1R)) M20(IO,_DIFFIO_R18n,_(DQ1R)/(DQ3R)/(DQ1R)) M21(IO,_DIFFIO_R19p,_(DQ1R)/(DQ3R)/(DQ1R)) M22(IO,_DIFFIO_R19n,_(DQ1R)/(DQ3R)/(DQ1R)) N16(IO,_DIFFIO_R25p) N17(IO,_DIFFIO_R21n) N18(IO,_DIFFIO_R21p,_(DQS1R/CQ1R#,DPCLK6)/(DQS1R/CQ1R#,DPCLK6)/(DQS1R/CQ1R#,DPCLK6)) N19(IO,_DIFFIO_R22p) N20(IO,_DIFFIO_R22n,_(DQ1R)/(DQ3R)/(DQ1R)) P17(IO,_DIFFIO_R30p) P20(IO,_VREFB5N0) P21(IO,_DIFFIO_R23p,_(DQ1R)/(DQ3R)/(DQ1R)) P22(IO,_DIFFIO_R23n,_(DQ1R)/(DQ3R)/(DQ1R)) R4(IO,_DIFFIO_L27p) R14(IO,_DIFFIO_B41p) R15(IO,_DIFFIO_B41n) R16(IO,_PLL4_CLKOUTn) R17(IO,_DIFFIO_R30n) R18(IO,_DIFFIO_R26n) R19(IO,_DIFFIO_R26p,_(DM1R/BWS#1R)/(DM3R/BWS#3R)/(DM1R/BWS#1R)) R20(IO,_DIFFIO_R28n,_(DQ3R)/(DQ3R)/(DQ1R)) R21(IO,_DIFFIO_R24p,_(DQ1R)/(DQ3R)/(DQ1R)) R22(IO,_DIFFIO_R24n,_(DQ1R)/(DQ3R)/(DQ1R)) T3(IO,_VREFB2N1) T4(IO,_(DQS3L/CQ3L#,CDPCLK1)/(DQS3L/CQ3L#,CDPCLK1)/(DQS3L/CQ3L#,CDPCLK1)) T10(IO,_DIFFIO_B13p) T14(IO,_DIFFIO_B36p) T15(IO,_DIFFIO_B36n,_(DQ2B)/(DQ5B)/(DQ5B)) T16(IO,_PLL4_CLKOUTp) T17(IO,_RUP3) T18(IO,_RDN3) T19(IO,_DIFFIO_R31p) T20(IO,_DIFFIO_R31n) U9(IO,_DIFFIO_B8p,_(DQ3B)/(DQ3B)/(DQ5B)) U10(IO,_DIFFIO_B16n,_(DQ5B)/(DQ3B)/(DQ5B)) U12(IO,_DIFFIO_B28p,_(DQ4B)/(DQ5B)/(DQ5B)) U13(IO,_DIFFIO_B32p) U14(IO,_DIFFIO_B33n) U15(IO,_DIFFIO_B34p) U16(IO,_DIFFIO_B40p) U17(IO,_DIFFIO_B40n) U19(IO,_DIFFIO_R34p) U20(IO,_DIFFIO_R34n,_(DQ3R)/(DQ3R)/(DQ1R)) V3(IO,_RDN1) V4(IO,_RUP1) V9(IO,_VREFB3N0) V10(IO,_DIFFIO_B15p,_(DQS3B/CQ3B#,DPCLK2)/(DQS3B/CQ3B#,DPCLK2)/(DQS3B/CQ3B#,DPCLK2)) V12(IO,_VREFB4N1) V13(IO,_DIFFIO_B31p,_(DQS2B/CQ3B,DPCLK5)/(DQS2B/CQ3B,DPCLK5)/(DQS2B/CQ3B,DPCLK5)) W13(IO,_DIFFIO_B26p,_(DQ4B)/(DQ5B)/(DQ5B)) W19(IO,_VREFB5N1) W20(IO,_(DQS3R/CQ3R#,CDPCLK4)/(DQS3R/CQ3R#,CDPCLK4)/(DQS3R/CQ3R#,CDPCLK4)) Y6(IO,_(DQS1B/CQ1B#,CDPCLK2)/(DQS1B/CQ1B#,CDPCLK2)/(DQS1B/CQ1B#,CDPCLK2))

## Buses and harness runs
bus fmc_io_in[0..7]
bus fmc_io_out[0..7]
bus io_in[0..7]
bus io_out[0..7]
bus LED[0..3] = port LED[0..3]
harness DDS_BUS_1 = port DDS_BUS_1
harness DDS_BUS_2 = port DDS_BUS_2
harness RIO_FMC = port RIO_FMC
harness SYS_SPI_FMC = port SYS_SPI_FMC

## Layout directives
differential pair: 100MHz_CLK_IN_N, 100MHz_CLK_IN_P, CLK_REFB_N, CLK_REFB_P, DDS_CLK_IN_N, DDS_CLK_IN_P, PLL3_OUT_N, PLL3_OUT_P, RESERVE_LVDS_0_N, RESERVE_LVDS_0_P, RESERVE_LVDS_1_N, RESERVE_LVDS_1_P, RESERVE_LVDS_2_N, RESERVE_LVDS_2_P, RESERVE_LVDS_3_N, RESERVE_LVDS_3_P, SYS_DDS_SYNC_N, SYS_DDS_SYNC_P, SYS_MISO_0_N, SYS_MISO_0_P, SYS_MISO_1_N, SYS_MISO_1_P, SYS_MISO_2_N, SYS_MISO_2_P, SYS_MISO_3_N, SYS_MISO_3_P, SYS_MOSI_0_N, SYS_MOSI_0_P, SYS_MOSI_1_N, SYS_MOSI_1_P, SYS_MOSI_2_N, SYS_MOSI_2_P, SYS_MOSI_3_N, SYS_MOSI_3_P, SYS_SCLK_N, SYS_SCLK_P, SYS_~{CS}_N, SYS_~{CS}_P
net class dds_bus_1_1: DDS_BUS_1.P1D0, DDS_BUS_1.P1D1, DDS_BUS_1.P1D2, DDS_BUS_1.P1D3, DDS_BUS_1.P1D4, DDS_BUS_1.P1D5, DDS_BUS_1.P1D6, DDS_BUS_1.P1D7, DDS_BUS_1.P1D8, DDS_BUS_1.P1D9, DDS_BUS_1.P1D10, DDS_BUS_1.P1D11, DDS_BUS_1.P1D12, DDS_BUS_1.P1D13
net class dds_bus_1_2: DDS_BUS_1.P2D0, DDS_BUS_1.P2D1, DDS_BUS_1.P2D2, DDS_BUS_1.P2D3, DDS_BUS_1.P2D4, DDS_BUS_1.P2D5, DDS_BUS_1.P2D6, DDS_BUS_1.P2D7, DDS_BUS_1.P2D8, DDS_BUS_1.P2D9, DDS_BUS_1.P2D10, DDS_BUS_1.P2D11, DDS_BUS_1.P2D12, DDS_BUS_1.P2D13
net class dds_bus_2_1: DDS_BUS_2.P1D0, DDS_BUS_2.P1D1, DDS_BUS_2.P1D2, DDS_BUS_2.P1D3, DDS_BUS_2.P1D4, DDS_BUS_2.P1D5, DDS_BUS_2.P1D6, DDS_BUS_2.P1D7, DDS_BUS_2.P1D8, DDS_BUS_2.P1D9, DDS_BUS_2.P1D10, DDS_BUS_2.P1D11, DDS_BUS_2.P1D12, DDS_BUS_2.P1D13
net class dds_bus_2_2: DDS_BUS_2.P2D0, DDS_BUS_2.P2D1, DDS_BUS_2.P2D2, DDS_BUS_2.P2D3, DDS_BUS_2.P2D4, DDS_BUS_2.P2D5, DDS_BUS_2.P2D6, DDS_BUS_2.P2D7, DDS_BUS_2.P2D8, DDS_BUS_2.P2D9, DDS_BUS_2.P2D10, DDS_BUS_2.P2D11, DDS_BUS_2.P2D12, DDS_BUS_2.P2D13

## Notes on the sheet
- Extrenal bus
- Internal bus
- PLL_100MHz_IN
- DDS_CLK_200MHz_IN
- Alternative CLK_10MHz
- mini-LVDS_E_3R  I/O Standard
- Перв. примен.
- Справ. №
- Подп. и дата
- Инв. № дубл.
- Взам. инв. №
- Инв. № подл.
- Изм.
- Лист
- № докум.
- Подп.
- Дата
- Форма 2а ГОСТ 2.104-2006
- Копировал
- Формат А2
- (in symbol CMP-0038-00002-2, part A) BANK 1
- (in symbol CMP-0038-00002-2, part B) BANK 2
- (in symbol CMP-0038-00002-2, part C) BANK 3
- (in symbol CMP-0038-00002-2, part D) BANK 4
- (in symbol CMP-0038-00002-2, part E) BANK 5
- (in symbol CMP-0038-00002-2, part F) BANK 6
- (in symbol CMP-0038-00002-2, part G) BANK 7
- (in symbol CMP-0038-00002-2, part H) BANK 8

## Library data of the parts
C40-C43 = Capacitor: Назначение: SMD-конденсатор; Наименование: GRM033D70J105ME01; Потребление, Вт: 0; Value: 1мкФ 6.3В X7T
R27 R28 R152-R159 R175-R177 R181 = Resistor: Наименование: Резистор; Назначение: SMD-резистор; Потребление, Вт: 0,001
  R27 R28 R152-R159 R176 R177 R181: Value: 100
  R175: Value: 200
R160-R163 R178 = Resistor-4: Потребление, Вт: 0.0; Наименование: TC124-FR-0733RL; Назначение: 4 Chip Resistor Array; Описание: TC124-FR-0733RL
U8 = CMP-0038-00002-2: Cyclone IV Family FPGA, 1.2V Core, 324 I/O Pins, 4 PLLs, 484-Pin FBGA, Speed Grade 8, Commercial Grade; Manufacturer: Altera; PackageDescription: 484-Pin FineLine Ball Grid Array (FBGA) - Wire Bond - A:2.40; ComponentLink2Description: Handbook; Code_JEDEC: MS-034-AAJ-1; ComponentLink2URL: http://www.altera.com/literature/hb/cyclone-iv/cyclone4-handbook.pdf; ComponentLink1URL: http://www.altera.com/; PackageVersion: ver1.0, Jun-2011; ComponentLink3URL: http://www.altera.com/literature/lit-dp.jsp?category=cyc%204&showspreadsheet=y; ComponentLink4Description: Package Specification; ComponentLink4URL: http://www.altera.com/devicepackaging/04R00247-02.pdf; ComponentLink1Description: Manufacturer URL; RevisionNote: DatasheetVersion updated. URLs added. PCB updated.; PackageReference: FBGA484_A-240; DatasheetVersion: ver1.6, Nov-2011; ComponentLink3Description: Pinout